# EAGLE design ESP_LoRa_GSM (EAGLE 9.6.2)
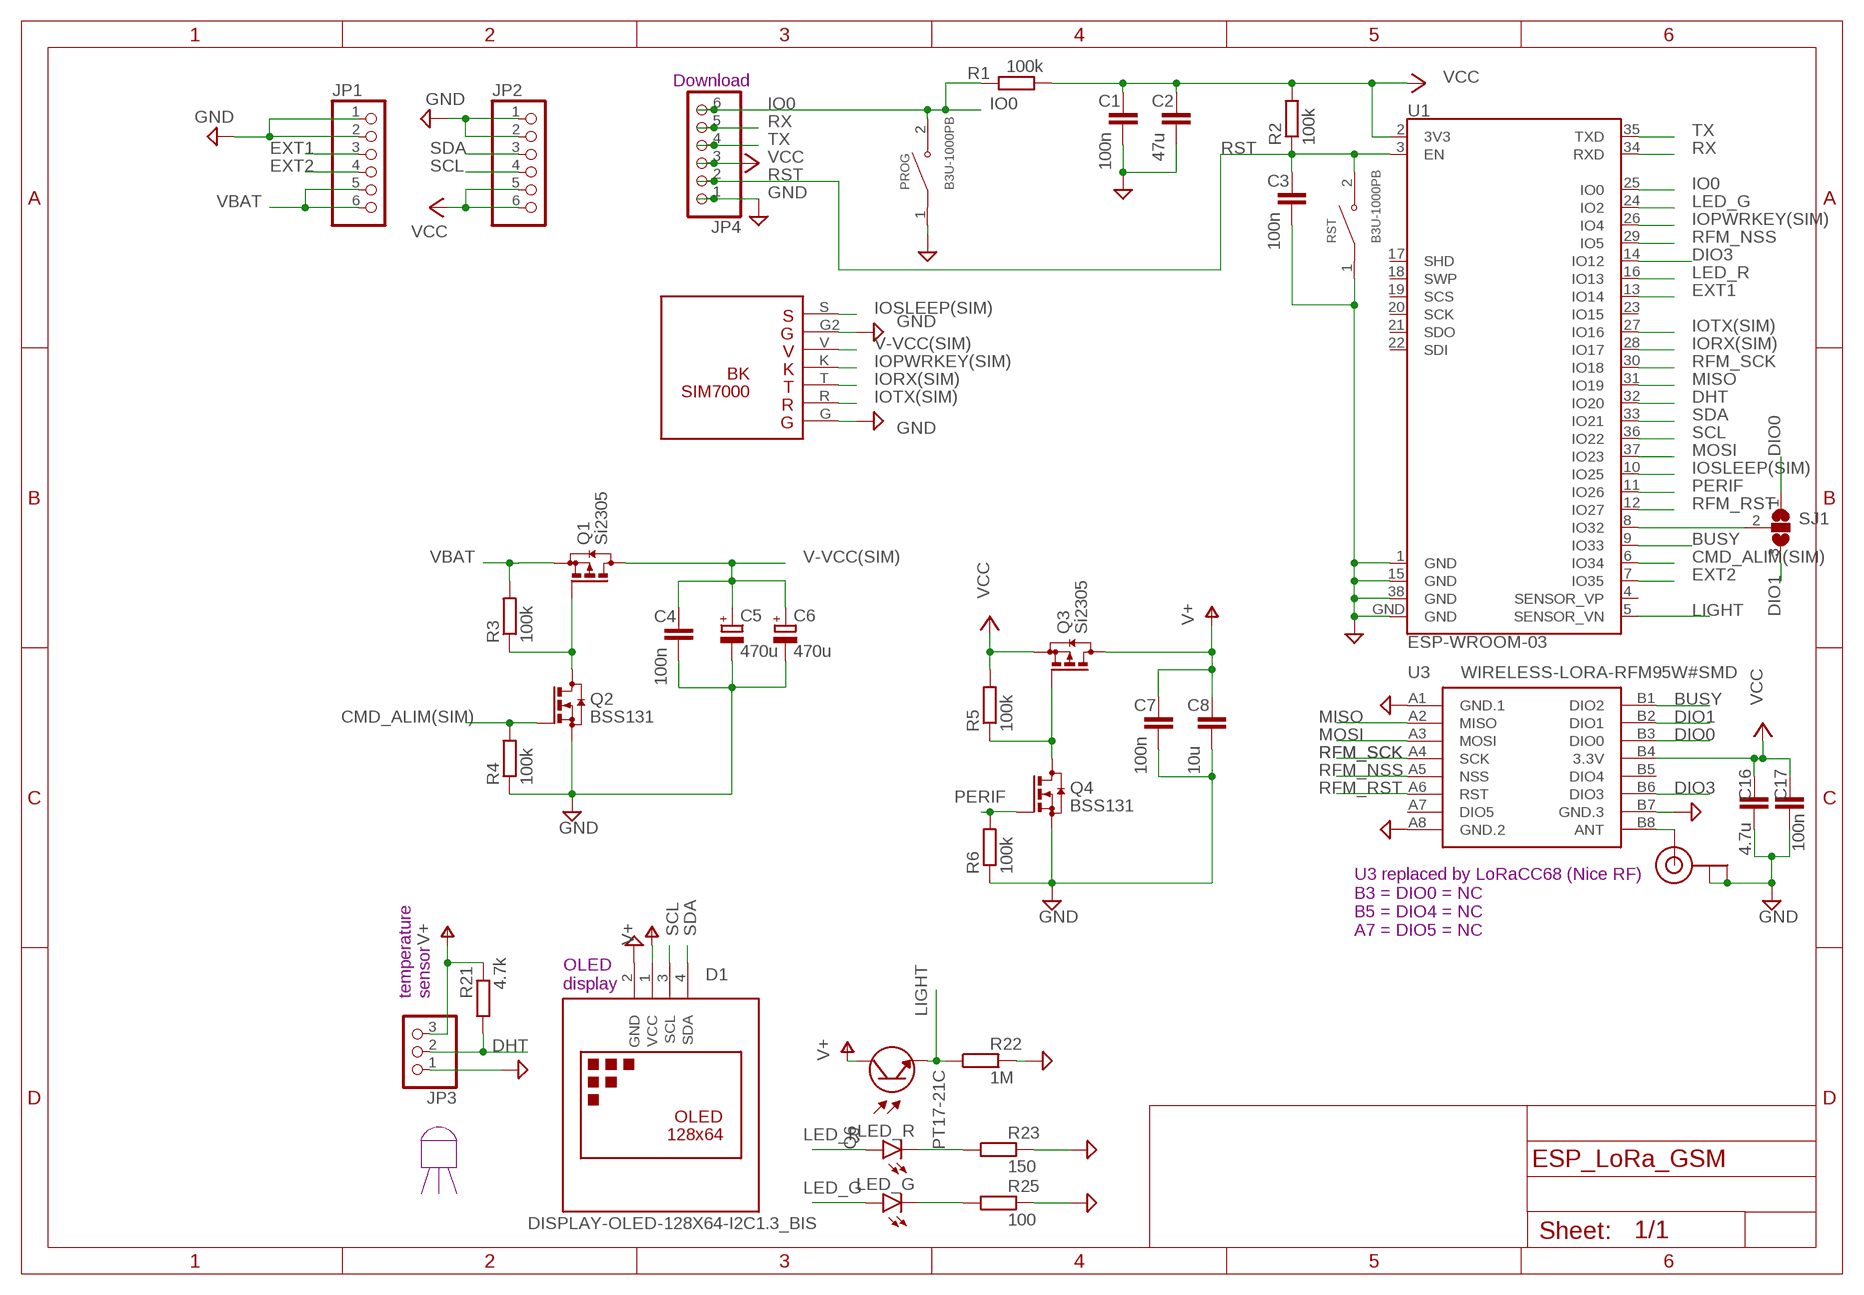
[diagram p0: schematic, sheet 1]

## Parts
C1  100n  CC1206  [C1206]
C2  47u  C  [C0805]
C3  100n  CC1206  [C1206]
C4  100n  CC1206  [C1206]
C5  470u  CPOL-EUCT7343  [CT7343]
C6  470u  CPOL-EUCT7343  [CT7343]
C7  100n  CC1206  [C1206]
C8  10u  CC1206  [C1206]
C16  4.7u  CC1210  [C1210]
C17  100n  CC1206  [C1206]
D1  DISPLAY-OLED-128X64-I2C1.3_BIS  [DISPLAY-OLED-128X64-1.3-I2C_BIS]
J1  U.FL  [U.FL]
JP1  PINHD-1X6S  [1X06S]
JP2  PINHD-1X6S  [1X06S]
JP3  PINHD-1X3  [1X03]
JP4  PINHD-1X6S  [1X06S]
LED_G  LEDSMT1206  [1206]
LED_R  LEDSMT1206  [1206]
PROG  B3U-1000PB  [SW_B3U-1000PB]
Q1  Si2305  BSS84  [SOT23]
Q2  BSS131  BSS123  [SOT23]
Q3  Si2305  BSS84  [SOT23]
Q4  BSS131  BSS123  [SOT23]
Q6  PT17-21C  [0805]
R1  100k  RR1206  [R1206]
R2  100k  RR1206  [R1206]
R3  100k  RR1206  [R1206]
R4  100k  RR1206  [R1206]
R5  100k  RR1206  [R1206]
R6  100k  RR1206  [R1206]
R21  4.7k  RR1206  [R1206]
R22  1M  RR1206  [R1206]
R23  150  RR1206  [R1206]
R25  100  RR1206  [R1206]
RST  B3U-1000PB  [SW_B3U-1000PB]
SJ1  SJ2W  [SJ_2]
U1  ESP-WROOM-03  [ESP-WROOM-03]
U2  BK7000-V2  [SIM7000-BK]
U3  WIRELESS-LORA-RFM95W#SMD  [WIRELESS-LORA-RFM95W#SMD]

## Nets
ANT: J1.3(SIGNAL) U3.B8(ANT)
BUSY: U1.9(IO33) U3.B1(DIO2)
CMD_ALIM(SIM): Q2.1(G) R4.2 U1.6(IO34)
DHT: JP3.2 R21.1 U1.32(IO20)
DIO0: SJ1.1 U3.B3(DIO0)
DIO1: SJ1.3 U3.B2(DIO1)
DIO3: U1.14(IO12) U3.B6(DIO3)
EXT1: JP1.3 U1.13(IO14)
EXT2: JP1.4 U1.7(IO35)
GND: C1.2 C2.2 C3.2 C4.2 C5.- C6.- C7.2 C8.2 C16.2 C17.2 D1.2(GND) J1.1(GND) J1.2(GND) JP1.1 JP1.2 JP2.1 JP2.2 JP3.1 JP4.1 PROG.1 Q2.2(S) Q4.2(S) R4.1 R6.1 R22.2 R23.2 R25.2 RST.1 U1.1(GND) U1.15(GND) U1.38(GND) U1.GND U2.G U2.G2 U3.A1(GND.1) U3.A8(GND.2) U3.B7(GND.3)
IO0: JP4.6 PROG.2 R1.2 U1.25(IO0)
IOPWRKEY(SIM): U1.26(IO4) U2.K
IORX(SIM): U1.28(IO17) U2.T
IOSLEEP(SIM): U1.10(IO25) U2.S
IOTX(SIM): U1.27(IO16) U2.R
LED_G: LED_G.A U1.24(IO2)
LED_R: LED_R.A U1.16(IO13)
LIGHT: Q6.1(E) R22.1 U1.5(SENSOR_VN)
MISO: U1.31(IO19) U3.A2(MISO)
MOSI: U1.37(IO23) U3.A3(MOSI)
N$1: Q1.1(G) Q2.3(D) R3.1
N$2: SJ1.2 U1.8(IO32)
N$3: LED_R.C R23.1
N$4: LED_G.C R25.1
N$9: Q3.1(G) Q4.3(D) R5.1
PERIF: Q4.1(G) R6.2 U1.11(IO26)
RFM_NSS: U1.29(IO5) U3.A5(NSS)
RFM_RST: U1.12(IO27) U3.A6(RST)
RFM_SCK: U1.30(IO18) U3.A4(SCK)
RST: C3.1 JP4.2 R2.1 RST.2 U1.3(EN)
RX: JP4.5 U1.34(RXD)
SCL: D1.3(SCL) JP2.4 U1.36(IO22)
SDA: D1.4(SDA) JP2.3 U1.33(IO21)
TX: JP4.4 U1.35(TXD)
V+: C7.1 C8.1 D1.1(VCC) JP3.3 Q3.3(D) Q6.2(C) R21.2
V-VCC(SIM): C4.1 C5.+ C6.+ Q1.3(D) U2.V
VBAT: JP1.5 JP1.6 Q1.2(S) R3.2
VCC: C1.1 C2.1 C16.1 C17.1 JP2.5 JP2.6 JP4.3 Q3.2(S) R1.1 R2.2 R5.2 U1.2(3V3) U3.B4(3.3V)
Unconnected: U1.4(SENSOR_VP) U1.17(SHD) U1.18(SWP) U1.19(SCS) U1.20(SCK) U1.21(SDO) U1.22(SDI) U1.23(IO15) U3.A7(DIO5) U3.B5(DIO4)

## Notes on the sheet
- Download
- U3 replaced by LoRaCC68 (Nice RF)
  B3 = DIO0 = NC
  B5 = DIO4 = NC
  A7 = DIO5 = NC
- OLED 
  display
- temperature
  sensor

## Library data of the parts
C1-C4 C7 C8 C16 C17 = eagle-ltspice:C: CAPACITOR, European symbol; SPICEMODEL: NONE; SPICEPREFIX: C
C5 C6 = rcl:CPOL-EU: POLARIZED CAPACITOR, European symbol; SPICEPREFIX: C
D1 = diy-modules1.8-perso:DISPLAY-OLED-128X64-I2C: 128x64 Dot Matrix OLED Module based on SSD1306 chip Variant with I2C interface More details available here: http://www.instructables.com/id/Monochrome-096-i2c-OLED-display-with-arduino-SSD13/ SSD1306 datasheet: https://cdn-shop.adafruit.com/datasheets/SSD1306.pdf Click here to find device on ebay.com <http://www.ebay.com/sch/oled+display+128x64+iic> Note: There are two variants: I2C and SPI. Search for the proper version.
J1 = microbuilder:U.FL: U.FL Antenna Connector
JP1 JP2 JP4 = pinheadCP:PINHD-1X6: PIN HEADER
JP3 = pinhead:PINHD-1X3: PIN HEADER
LED_G LED_R = led:LED: LED OSRAM: - CHIPLED LG R971, LG N971, LY N971, LG Q971, LY Q971, LO R971, LY R971 LH N974, LH R974 LS Q976, LO Q976, LY Q976 LO Q996 - Hyper CHIPLED LW Q18S LB Q993, LB Q99A, LB R99A - SideLED LS A670, LO A670, LY A670, LG A670, LP A670 LB A673, LV A673, LT A673, LW A673 LH A674 LY A675 LS A676, LA A676, LO A676, LY A676, LW A676 LS A679, LY A679, LG A679 - Hyper Micro SIDELED® LS Y876, LA Y876, LO Y876, LY Y876 LT Y87S - SmartLED LW L88C, LW L88S LB L89C, LB L89S, LG L890 LS L89K, LO L89K, LY L89K LS L896, LA L896, LO L896, LY L896 - TOPLED LS T670, LO T670, LY T670, LG T670, LP T670 LSG T670, LSP T670, LSY T670, LOP T670, LYG T670 LG T671, LOG T671, LSG T671 LB T673, LV T673, LT T673, LW T673 LH T674 LS T676, LA T676, LO T676, LY T676, LB T676, LH T676, LSB T676, LW T676 LB T67C, LV T67C, LT T67C, LS T67K, LO T67K, LY T67K, LW E67C LS E67B, LA E67B, LO E67B, LY E67B, LB E67C, LV E67C, LT E67C LW T67C LS T679, LY T679, LG T679 LS T770, LO T770, LY T770, LG T770, LP T770 LB T773, LV T773, LT T773, LW T773 LH T774 LS E675, LA E675, LY E675, LS T675 LS T776, LA T776, LO T776, LY T776, LB T776 LHGB T686 LT T68C, LB T68C - Hyper Mini TOPLED® LB M676 - Mini TOPLED Santana® LG M470 LS M47K, LO M47K, LY M47K Source: http://www.osram.convergy.de LUXEON: - LUMILED® LXK2-PW12-R00, LXK2-PW12-S00, LXK2-PW14-U00, LXK2-PW14-V00 LXK2-PM12-R00, LXK2-PM12-S00, LXK2-PM14-U00 LXK2-PE12-Q00, LXK2-PE12-R00, LXK2-PE12-S00, LXK2-PE14-T00, LXK2-PE14-U00 LXK2-PB12-K00, LXK2-PB12-L00, LXK2-PB12-M00, LXK2-PB14-N00, LXK2-PB14-P00, LXK2-PB14-Q00 LXK2-PR12-L00, LXK2-PR12-M00, LXK2-PR14-Q00, LXK2-PR14-R00 LXK2-PD12-Q00, LXK2-PD12-R00, LXK2-PD12-S00 LXK2-PH12-R00, LXK2-PH12-S00 LXK2-PL12-P00, LXK2-PL12-Q00, LXK2-PL12-R00 Source: www.luxeon.com KINGBRIGHT: KA-3528ASYC Source: www.kingbright.com
PROG RST = SnapEDA-Library2:B3U-1000P: Switch Tactile N.O. SPST Round Button Gull Wing 0.05A 12VDC 1.5N SMD Embossed T/R
Q1 Q3 = transistor-small-signal:BSS84: P-CHANNEL MOS FET
Q2 Q4 = transistor-small-signal:BSS123: N-CHANNEL MOS FET
Q6 = SFH_300-3_4:PT17-21C: PT17-21C/L41/TR8 Phototransistor Manufacturer : Everlight Elec Package : 0805 20mA NPN 30V 75mW 100nA 940nm ROHS
R1-R6 R21-R23 R25 = eagle-ltspice:R: RESISTOR, European symbol; SPICEMODEL: NONE; SPICEPREFIX: R
SJ1 = jumper:SJ2W: SMD solder JUMPER
U1 = esp32-sparkfun (1):ESP-WROOM-03; OC_FARNELL: unknown
U2 = MyLIB:BK7000-V2
U3 = diy-modules:WIRELESS-LORA-RFM95W: 868/915 MHz LoRa Radio Transceiver Module based on SX1276 chip Click here to find device on ebay.com <http://www.ebay.com/sch/RFM95W+transceiver>

## Board
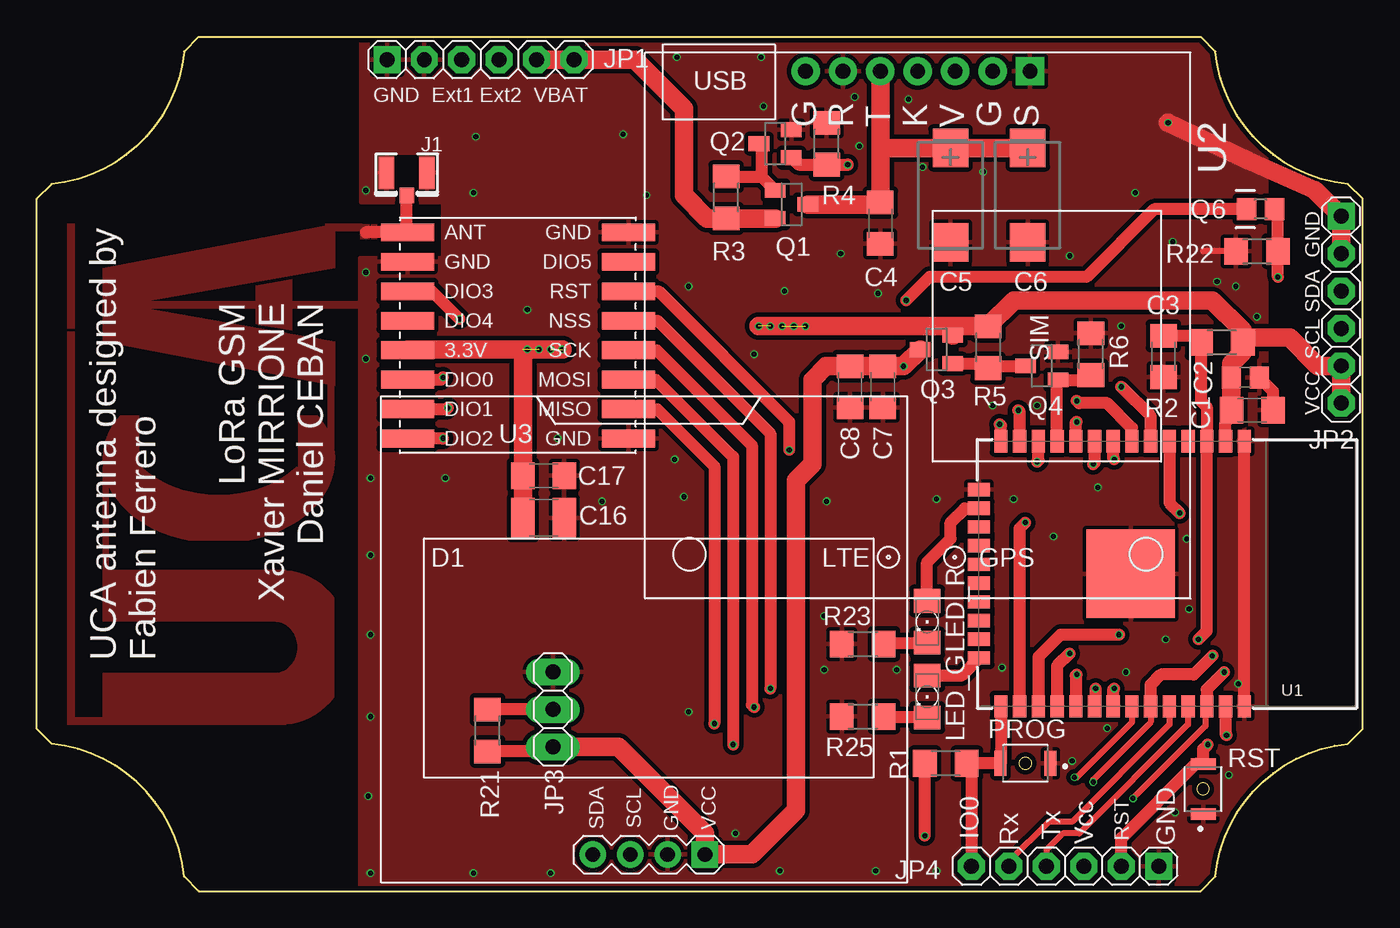
[diagram p1: board, top side]
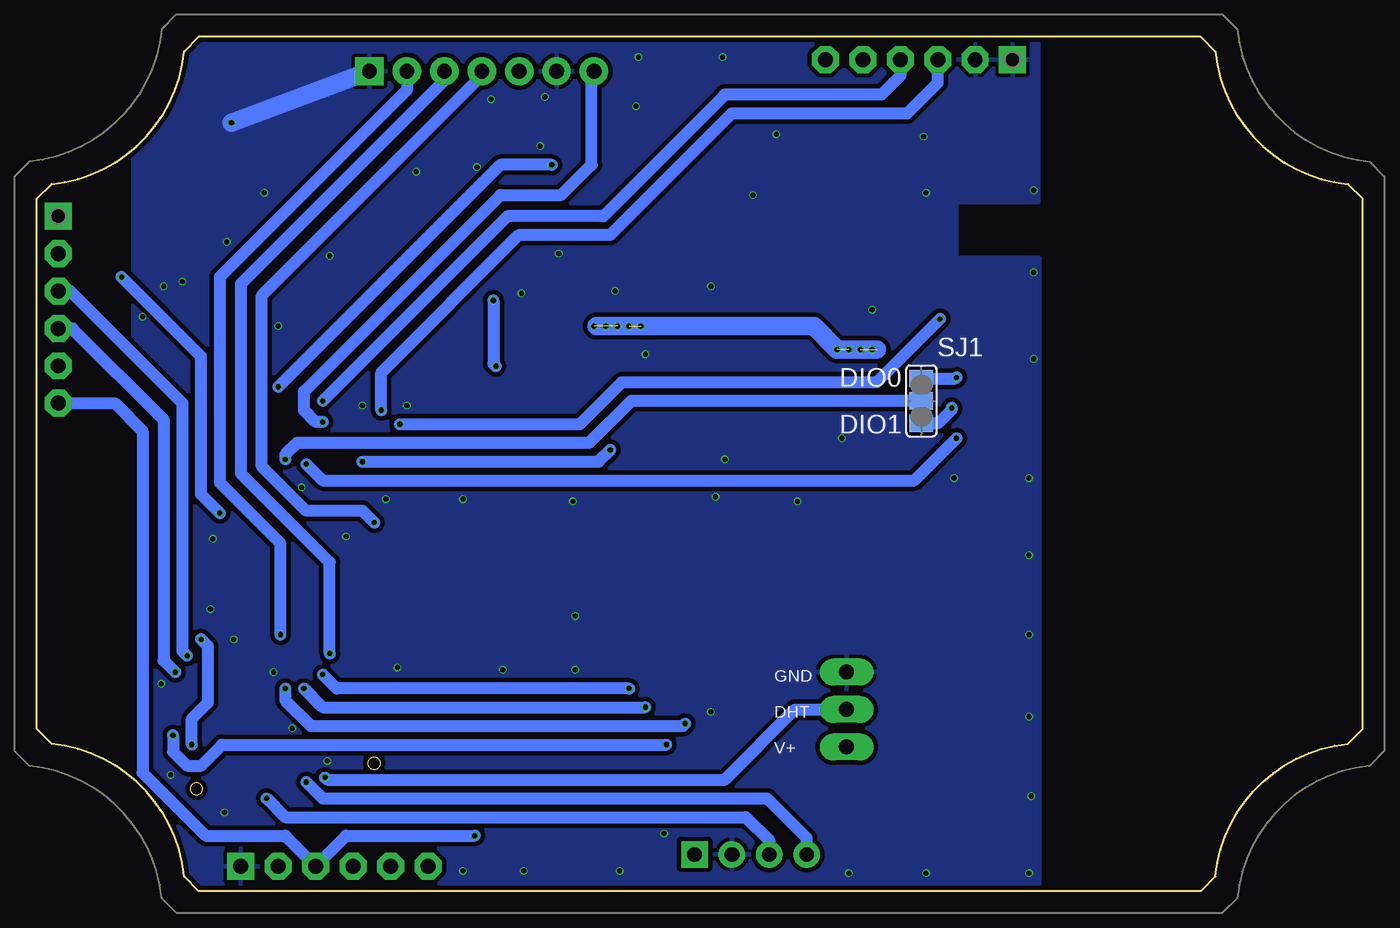
[diagram p2: board, bottom side, seen from below]

Size 90 x 58 mm. Coordinates in mm from the lower left corner, seen from the top.
Outline: 10,57 arc-79 1,48 0,47 0,11 1,10 arc-79 10,1 11,0 79,0 80,1 arc-79 89,10 90,11 90,47 89,48 arc-79 80,57 79,58 11,58 10,57
Copper layers (1*16): Top 0.035mm / dielectric 1.6mm / Bottom 0.035mm
Design rules "jlcpcb-2layers *": minimum track width 5mil, minimum drill 0.3mm, track to track 5mil, track to pad 5mil, pad to pad 5mil, via to via 5mil, smd to smd 5mil, copper to edge 2mil, drill to drill 6mil, minimum pad ring 10mil, minimum via ring 3mil, stop-mask expansion 4mil, vias tented up to drill 0mil, thermal gap 10mil

### Footprints (pad centres in the part's own frame; a part is rotated, then mirrored left to right if it is on the bottom)
C1206 = smd 1.6 x 1.8: 1 -1.4,0; 2 1.4,0
C0805 = smd 1.3 x 1.5: 1 -0.95,0; 2 0.95,0
CT7343 = smd 2.6 x 2.4: + -3.2,0; - 3.2,0
C1210 = smd 1.6 x 2.7: 1 -1.4,0; 2 1.4,0
DISPLAY-OLED-128X64-1.3-I2C_BIS = drill 1 square: 1 -3.81,14.605 | drill 1: 2 -1.27,14.605; 3 1.27,14.605; 4 3.81,14.605
U.FL = smd 2.2 x 1.05: 1 0,1.375; 2 0,-1.375 | smd 1.05 x 1: 3 1.525,0
1X06S = drill 1.016 square: 1 -6.35,0 | drill 1.016 octagon: 2 -3.81,0; 3 -1.27,0; 4 1.27,0; 5 3.81,0; 6 6.35,0
1X03 = drill 1.016 long: 1 -2.54,0; 2 0,0; 3 2.54,0
1206 = smd 1.6 x 1.803: A -1.422,0; C 1.422,0
SW_B3U-1000PB = smd 0.8 x 1.7: 1 -1.7,0; 2 1.7,0
SOT23 = smd 1 x 1.4: 1 -0.95,-1.1; 2 0.95,-1.1; 3 0,1.1
0805 = smd 1.3 x 1.5: 1 0.72,0; 2 -1.18,0
R1206 = smd 1.6 x 1.803: 1 -1.422,0; 2 1.422,0
SJ_2 = smd 1.168 x 1.6: 1 -1.524,0; 2 0,0; 3 1.524,0
ESP-WROOM-03 = smd 0.9 x 1.5: 1 7.7,9; 2 6.43,9; 3 5.16,9; 4 3.89,9; 5 2.62,9; 6 1.35,9; 7 0.08,9; 8 -1.19,9; 9 -2.46,9; 10 -3.73,9; 11 -5,9; 12 -6.27,9; 13 -7.54,9; 14 -8.81,9; 25 -8.81,-9; 26 -7.54,-9; 27 -6.27,-9; 28 -5,-9; 29 -3.73,-9; 30 -2.46,-9; 31 -1.19,-9; 32 0.08,-9; 33 1.35,-9; 34 2.62,-9; 35 3.89,-9; 36 5.16,-9; 37 6.43,-9; 38 7.7,-9 | smd 1.5 x 0.9: 15 -10.3,5.715; 16 -10.3,4.445; 17 -10.3,3.175; 18 -10.3,1.905; 19 -10.3,0.635; 20 -10.3,-0.635; 21 -10.3,-1.905; 22 -10.3,-3.175; 23 -10.3,-4.445; 24 -10.3,-5.715 | smd 6 x 6: GND 0,0
SIM7000-BK = drill 1 pad 1.93 square: G 0,7.62 | drill 1 pad 1.93: G2 0,-5.08; K 0,0; R 0,5.08; S 0,-7.62; T 0,2.54; V 0,-2.54
WIRELESS-LORA-RFM95W#SMD = smd 3.6 x 1.2: A1 -7.5,7; A2 -7.5,5; A3 -7.5,3; A4 -7.5,1; A5 -7.5,-1; A6 -7.5,-3; A7 -7.5,-5; A8 -7.5,-7; B1 7.5,7; B2 7.5,5; B3 7.5,3; B4 7.5,1; B5 7.5,-1; B6 7.5,-3; B7 7.5,-5; B8 7.5,-7

### Placement (x,y rotation side)
C1  82.5,32.65 0 top
C2  82.03,34.87 0 top
C3  76.47,36.3 270 top
C4  57.26,45.35 270 top
C5  62.02,47.25 270 top
C6  67.26,47.25 270 top
C7  57.42,34.23 270 top
C8  55.2,34.23 270 top
C16  34.4,25.34 0 top
C17  34.4,28.2 0 top
D1  41.55,17.09 180 top
J1  25.11,48.77 270 top
JP1  30.11,56.46 0 top
JP2  88.54,39.47 270 top
JP3  35.04,12.33 270 top
JP4  69.8,1.69 180 top
LED_G  60.44,13.2 270 top
LED_R  60.44,18.28 270 top
PROG  67.1,8.68 180 top
Q1  51.23,46.62 270 top
Q2  50.12,50.74 90 top
Q3  61.07,36.77 90 top
Q4  68.22,35.66 90 top
Q6  83.3,46.3 0 top
R1  61.71,8.68 0 top
R2  80.44,37.25 0 top
R3  46.78,47.09 270 top
R4  53.61,50.74 270 top
R5  64.56,36.93 90 top
R6  71.55,36.46 270 top
R21  30.59,10.9 270 top
R22  82.82,43.44 180 top
R23  56.07,16.77 180 top
R25  56.07,11.85 180 top
RST  79.17,6.93 90 top
SJ1  29.96,33.28 270 bottom
U1  74.26,21.54 0 top
U2  59.8,55.67 270 top
U3  32.66,37.73 180 top

### Tracks (layer width: path | path; a pad name or v marks a point on that pad's centre or on a via)
ANT
  Top 0.813: J1.3 25.11,44.77 U3.B8 22.35,44.73 22.34,44.71
  pour Top: 16.92,11.3 2.07,11.3 2.07,38 2.57,38 2.57,11.8 4.47,11.8 4.47,14.8 16.12,14.8 16.26,14.8 16.4,14.83 16.53,14.86 16.66,14.9 16.79,14.96 16.91,15.03 17.03,15.12 17.14,15.21 17.24,15.31 17.33,15.42 17.41,15.55 17.49,15.67 17.55,15.81 17.6,15.95 17.64,16.1 17.67,16.25 17.69,16.4 17.7,16.55 17.69,16.7 17.67,16.85 17.64,17 17.6,17.15 17.55,17.29 17.49,17.42 17.41,17.55 17.33,17.67 17.24,17.79 17.14,17.89 17.03,17.98 16.91,18.06 16.79,18.13 16.66,18.19 16.53,18.24 16.4,18.27 16.26,18.29 16.12,18.3 4.47,18.3 4.47,28.8 4.5,28.8 4.48,29.41 4.54,30.02 4.69,30.62 4.93,31.22 5.25,31.79 5.65,32.3 6.96,32.3 6.96,28.8 7.11,28.8 7.44,28.51 7.79,28.24 8.16,28 8.57,27.77 8.99,27.57 9.43,27.4 9.9,27.24 10.37,27.12 10.86,27.02 11.35,26.95 11.85,26.91 12.36,26.9 12.86,26.91 13.36,26.95 13.86,27.02 14.34,27.12 14.82,27.24 15.28,27.4 15.72,27.57 16.15,27.77 16.56,28 16.92,28.24 17.28,28.51 17.61,28.8 17.75,28.8 17.75,32.3 19.06,32.3 19.19,32.15 19.31,31.99 19.42,31.83 19.53,31.67 19.63,31.5 19.72,31.34 19.72,34.4 4.47,37.3 4.47,42.3 19.57,45.17 19.57,45.3 22.07,45.3 22.07,45.29 22.57,45.29 22.57,45.13 22.7,45.13 22.7,45.29 23.48,45.29 23.48,44.28 22.7,44.28 22.7,44.44 22.57,44.44 22.57,44.28 21.93,44.28 21.93,44.8 20.24,44.8 20.24,42.3 7.54,40.05 14.85,40.05 14.85,41.1 17.34,41.55 17.34,40.05 21.93,40.05 21.93,40.3 22.32,40.3 22.32,39.3 21.93,39.3 21.93,39.55 17.34,39.55 17.34,38.05 16.15,38.26 15.01,38.44 15.01,38.47 14.85,38.5 14.85,39.55 7.54,39.55 20.24,37.3 20.24,34.3 20.17,34.31 20.17,30.06 20.23,29.51 20.23,28.97 20.15,28.42 19.99,27.88 19.77,27.36 19.49,26.86 19.12,26.36 18.7,25.91 18.24,25.5 17.69,25.1 17.11,24.75 16.5,24.45 15.83,24.18 15.14,23.96 14.43,23.8 10.29,23.8 9.68,23.93 9.09,24.11 8.5,24.32 7.97,24.56 7.45,24.84 6.95,25.15 6.51,25.47 6.1,25.83 5.72,26.22 5.41,26.61 5.13,27.03 4.89,27.47 4.89,21.8 16.92,21.8 16.92,21.78 17.34,21.73 17.75,21.64 18.14,21.5 18.53,21.33 18.9,21.12 19.25,20.88 19.58,20.6 19.89,20.29 20.17,19.95 20.17,13.15 19.89,12.81 19.58,12.5 19.25,12.22 18.9,11.98 18.53,11.77 18.14,11.6 17.75,11.46 17.34,11.37 16.92,11.31
ANT1
  pour Top: 2.57,38.2 2.07,38.2 2.07,45.3 2.57,45.3
BUSY  (via drill 0.35)
  Top 0.813: U1.9 71.8,29.09 v71.71,29 | v27.57,30.74 27.56,30.73 U3.B1
  Bottom 0.813: v71.71,29 70.6,27.89 30.43,27.89 v27.57,30.74
CMD_ALIM(SIM)  (via drill 0.35)
  Top 0.813: Q2.1 51.69,49.32 R4.2 55.03,49.32 v55.04,49.32 | U1.6 75.61,32.24 v73.61,34.24
  Bottom 0.813: v55.04,49.32 58.53,49.32 v73.61,34.24
DHT  (via drill 0.35)
  Top 0.406: U1.32 74.34,11.47 70.6,7.72 v70.44,7.72
  Top 0.813: JP3.2 R21.1
  Bottom 0.813: v70.44,7.72 70.28,7.57 43.29,7.57 38.53,12.33 JP3.2
DIO0  (via drill 0.35)
  Top 0.813: U3.B3 27.43,34.73 v27.57,34.87
  Bottom 0.813: v27.57,34.87 27.64,34.81 SJ1.1
DIO1  (via drill 0.35)
  Top 0.813: U3.B2 27.81,32.73 v27.89,32.81
  Bottom 0.813: v27.89,32.81 27.89,32.71 28.84,31.76 SJ1.3
DIO3  (via drill 0.35)
  Top 0.813: U1.14 65.45,31.61 v65.36,31.7 | v28.69,38.84 26.8,40.73 U3.B6
  Bottom 0.813: v65.36,31.7 53.13,31.7 50.28,34.55 32.97,34.55 v28.69,38.84
EXT1  (via drill 0.35)
  Top 0.813: U1.13 66.72,32.56 v66.63,32.65
  Bottom 0.813: JP1.3 28.84,54.87 30.91,52.81 42.81,52.81 51.07,44.55 57.26,44.55 66.63,35.19 v66.63,32.65
EXT2  (via drill 0.35)
  Top 0.813: U1.7 74.34,31.45 72.66,33.12 70.75,33.12 v70.6,33.28
  Bottom 0.813: JP1.4 31.38,55.35 32.65,54.08 43.29,54.08 51.55,45.82 58.05,45.82 v70.6,33.28
GND  (via drill 0.35)
  Top 0.406: R22.2 79.17,43.44
  Top 0.813: U1.38 U1.1 | C2.2 83.9,33.94 C1.2
  Top 1.27: v76.79,52.17 82.18,49.63 86.76,47.6 JP2.1 JP2.2
  Bottom 1.27: v76.79,52.17 U2.G
  other vias: 77.11,44.08 81.39,41.06 82.82,39 80.12,41.38 69.01,24.07 72.03,27.41 73.93,14.87 77.26,5.34 56.94,1.37 61.07,1.37 64.88,32.96 67.9,32.96 73.61,38.36 50.44,1.37 34.88,1.22 29.64,1.22 22.65,1.22 22.5,6.45 22.65,11.85 22.65,17.41 22.65,22.8 22.65,28.04 22.34,36.14 22.34,42.01 22.34,47.57 29.64,47.41 41.39,47.25 39.8,51.38 29.8,51.22 44.24,41.06 33.29,39.47 27.73,28.04 38.37,26.46 43.93,26.77 43.29,29.31 35.35,30.74 48.69,36.46 50.75,40.74 57.1,40.59 54.56,43.28 53.61,26.46 61.07,26.61 53.45,18.68 53.45,15.03 58.37,15.03 65.52,15.18 66.31,26.61 76.63,17.09 81.55,14.07 80.92,7.88 70.28,8.83 72.66,11.06 78.06,23.92 78.22,19.15 43.45,56.62 49.16,56.62 44.24,12.17 47.42,3.91 55.52,53.92 59.17,53.76 64.25,48.84 70.12,43.12 74.57,47.41 49.32,53.28 55.83,50.59 60.12,49.16
  pour Top (isolate 0.305): 21.93,42.97 21.93,0.1 36.31,0.1 79.01,0.1 79.96,1.06 80.12,2.96 81.71,6.29 83.46,8.04 83.46,11.85 83.46,50.11 82.19,51.38 81.23,52.81 80.44,54.4 79.96,56.14 79.8,56.94 78.85,57.89 22.02,57.89 22.02,46.78 27.57,46.78 27.57,44.55 27.57,42.97
  pour Bottom (isolate 0.305): 21.93,42.97 21.93,0.1 79.01,0.1 79.96,1.06 80.12,2.96 81.71,6.29 83.46,8.04 83.46,50.11 82.19,51.38 81.23,52.81 80.44,54.4 79.96,56.14 79.8,56.94 78.85,57.89 22.02,57.89 22.02,46.78 27.57,46.78 27.57,42.97
IO0
  Top 0.813: U1.25 65.45,8.72 PROG.2 R1.2 63.45,8.35 JP4.6
IOPWRKEY(SIM)  (via drill 0.35)
  Top 0.813: U1.26 66.72,24.64 v67.1,25.03
  Bottom 0.813: U2.K 59.8,55.35 74.72,40.43 74.72,28.84 71.71,25.82 67.9,25.82 v67.1,25.03
IORX(SIM)  (via drill 0.35)
  Top 0.813: U1.28 69.26,15.28 v70.12,16.14
  Bottom 0.813: U2.T 62.34,55.03 76.15,41.22 76.15,28.36 70.12,22.33 v70.12,16.14
IOSLEEP(SIM)  (via drill 0.35)
  Top 0.813: U1.10 70.53,31.79 v70.6,31.85
  Bottom 0.813: U2.S 52.34,55.51 52.34,49.32 54.4,47.25 58.53,47.25 71.87,33.92 71.87,32.65 71.07,31.85 v70.6,31.85
IOTX(SIM)  (via drill 0.35)
  Top 0.813: v73.45,17.41 69.48,17.41 67.99,15.91 U1.27
  Bottom 0.813: U2.R 64.88,54.4 77.58,41.7 77.58,27.73 73.45,23.6 v73.45,17.41
LED_G
  Top 0.813: U1.24 62.75,14.62 LED_G.A
LED_R
  Top 0.813: LED_R.A 60.44,22.33 62.02,23.92 62.02,25.03 62.98,25.99 U1.16
LIGHT  (via drill 0.35)
  Top 0.813: v84.25,41.7 84.25,43.44 R22.1 84.24,46.07 Q6.1 | v77.58,25.66 76.88,26.37 U1.5
  Bottom 0.813: v77.58,25.66 78.85,26.93 78.85,36.3 v84.25,41.7
MISO  (via drill 0.35)
  Top 0.813: U3.A2 42.1,32.73 45.99,28.84 v45.99,11.38 | U1.31 73.07,13.69 v73.14,13.76
  Bottom 0.813: v73.14,13.76 73.14,12.96 71.39,11.22 46.15,11.22 v45.99,11.38
MOSI  (via drill 0.35)
  Top 0.813: U3.A3 42,34.73 47.26,29.47 v47.26,9.95 | v80.76,10.58 80.69,10.65 U1.37
  Bottom 0.813: v80.76,10.58 80.76,9.47 79.8,8.52 78.85,8.52 77.42,9.95 v47.26,9.95
N$1
  Top 0.813: R3.1 49.18,48.52 | 49.18,48.52 Q1.1 | Q2.3 49.18,50.58 49.18,48.52
N$2  (via drill 0.35)
  Top 0.813: v73.14,29.31 73.07,29.38 U1.8
  Bottom 0.813: SJ1.2 49.64,33.28 52.5,30.43 72.34,30.43 73.14,29.63 v73.14,29.31
N$3
  Top 0.813: R23.1 57.58,16.86 LED_R.C
N$4
  Top 0.813: LED_G.C 57.56,11.78 R25.1
N$9
  Top 0.813: Q3.1 64.25,35.83 R5.1 64.72,35.66 Q4.3
PERIF
  Top 0.813: U1.11 69.26,34.66 Q4.1 71.23,34.71 R6.2
RFM_NSS  (via drill 0.35)
  Top 0.813: U3.A5 42.13,38.73 49.8,31.06 v49.8,13.76 | v70.6,14.71 70.53,14.64 U1.29
  Bottom 0.813: v49.8,13.76 69.64,13.76 v70.6,14.71
RFM_RST  (via drill 0.35)
  Top 0.813: U3.A6 42.2,40.73 51.07,31.85 v51.07,29.95 | v67.9,29.16 67.99,29.25 U1.12
  Bottom 0.813: v51.07,29.95 51.86,29.16 v67.9,29.16
RFM_SCK  (via drill 0.35)
  Top 0.813: U3.A4 42.07,36.73 48.53,30.27 48.53,12.65 v48.69,12.49 | v71.87,13.76 71.87,12.61 U1.30
  Bottom 0.813: v48.69,12.49 70.6,12.49 v71.87,13.76
RST  (via drill 0.35)
  Top 0.813: C3.1 78.57,37.7 R2.1 79.02,33.28 79.42,32.88 U1.3 79.42,17.66 v78.85,17.09 | JP4.2 73.61,3.6 78.65,8.63 RST.2 79.17,9.63 v79.49,9.95
  Bottom 0.813: v79.49,9.95 79.49,11.69 78.37,12.8 78.37,16.61 v78.85,17.09
RX
  Top 0.406: U1.34 76.88,11.31 70.28,4.71 68.69,4.71 65.99,2.01 JP4.5
SCL  (via drill 0.35)
  Top 0.406: U1.36 79.33,12.45 79.33,11.22 v74.41,6.3
  Top 0.813: v80.6,14.87 79.42,13.69 U1.36
  Bottom 0.813: JP2.4 87.58,38.2 81.39,32.01 81.39,15.66 v80.6,14.87 | D1.3 40.27,3.44 41.86,5.03 73.14,5.03 v74.41,6.3
SDA  (via drill 0.35)
  Top 0.406: U1.33 75.61,11.47 71.71,7.57 v71.71,7.41
  Top 0.813: U1.33 75.61,14.01 76.31,14.71 78.53,14.71 v79.8,15.98
  Bottom 0.813: JP2.3 87.74,40.74 80.12,33.12 80.12,16.3 v79.8,15.98 | D1.4 37.73,3.6 40.43,6.3 70.6,6.3 v71.71,7.41
TX
  Top 0.406: U1.35 78.15,11.31 70.75,3.91 69.64,3.91 68.53,2.8 JP4.4
V+  (via drill 0.35)
  Top 0.813: Q6.2 75.83,46.3 71.23,41.7 60.59,41.7 v59.01,40.11 | JP3.3 34.73,9.48 R21.2
  Top 1.27: Q3.3 v58.83,35.64 C7.1 C8.1 53.58,35.64 52.66,34.71 52.66,29 51.55,27.89 51.55,5.5 48.53,2.49 D1.1 45.35,3.91 39.48,9.79 JP3.3
  Bottom 0.813: v59.01,40.11 59.01,35.82 v58.83,35.64
V-VCC(SIM)
  Top 1.27: C6.+ C5.+ 57.26,50.45 | 57.26,50.45 U2.V | 57.26,50.45 C4.1 57.26,46.62 Q1.3
VBAT
  Top 1.27: JP1.5 35.83,56.46 JP1.6 40.59,56.46 43.93,53.13 43.93,47.25 45.51,45.67 R3.2 Q1.2
VCC  (via drill 0.35)  (7 unrouted)
  Top 0.813: U1.2 80.69,31.81 81.1,32.22 C1.1 | v60.28,3.76 R1.1
  Top 1.27: R2.2 82.18,37.57 85.04,37.57 86.95,35.66 JP2.5 JP2.6 | R2.2 81.86,36.61 81.08,35.82 C2.1 81.08,32.67 C1.1 | R2.2 81.86,38.05 79.8,40.11 66.32,40.11 R5.2 62.18,38.36 | 62.18,38.36 v49,38.36 | Q3.2 62.17,38.34 62.18,38.36 | U3.B4 25.2,36.78 32.97,36.78 | 32.97,36.78 v35.67,36.78 | C16.1 C17.1 33,36.75 32.97,36.78
  Bottom 0.813: JP2.6 84.72,33.12 82.82,31.22 82.82,8.04 78.53,3.76 73.14,3.76 JP4.3 69.01,3.76 v60.28,3.76
  Bottom 1.27: 32.97,36.78 v35.67,36.78 37.26,38.36 v49.01,38.36 | v49,38.36 v49.01,38.36 | v49.01,38.36 52.02,38.36
  other vias: 34.88,36.77 34.08,36.77 33.29,36.77 49.79,38.36 50.59,38.36 51.38,38.36 52.17,38.36

### Text on the board
tNames: GND Ext1 Ext2 VBAT | LoRa GSM / Xavier MIRRIONE / Daniel CEBAN | VCC SCL SDA GND | UCA antenna designed by / Fabien Ferrero | GND | IO0 | Vcc | RST | Rx | Tx
bNames: DIO0 | DIO1 | GND / / DHT / / V+
tValues: 84 x 58 mm